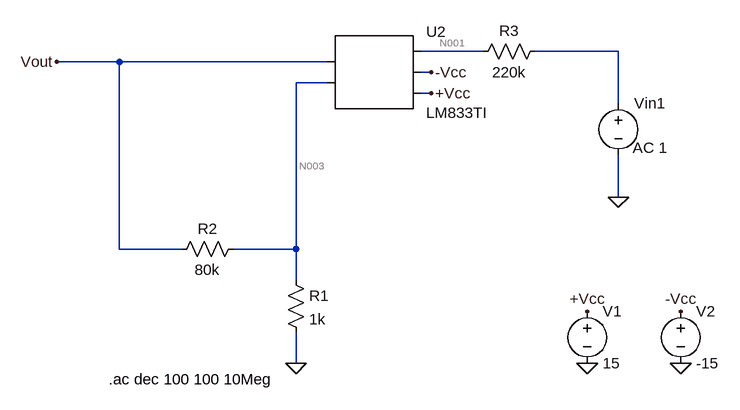
[diagram p0: schematic opamp LM833 TI.asc]
* opamp LM833 TI.asc
R1 N003 0 1k
R2 N003 Vout 80k
R3 N002 N001 220k
Vin1 N002 0 AC 1
V1 +Vcc 0 15
V2 -Vcc 0 -15
* U2: LM833TI (symbol AutoGenerated\LM833TI not available, pins judged from their places): pin1=Vout pin2=N003 pin3=N001 pin4=-Vcc pin5=+Vcc
.ac dec 100 100 10Meg
.backanno
.end

* Results of the author's LTspice run, read from the files saved beside the schematic
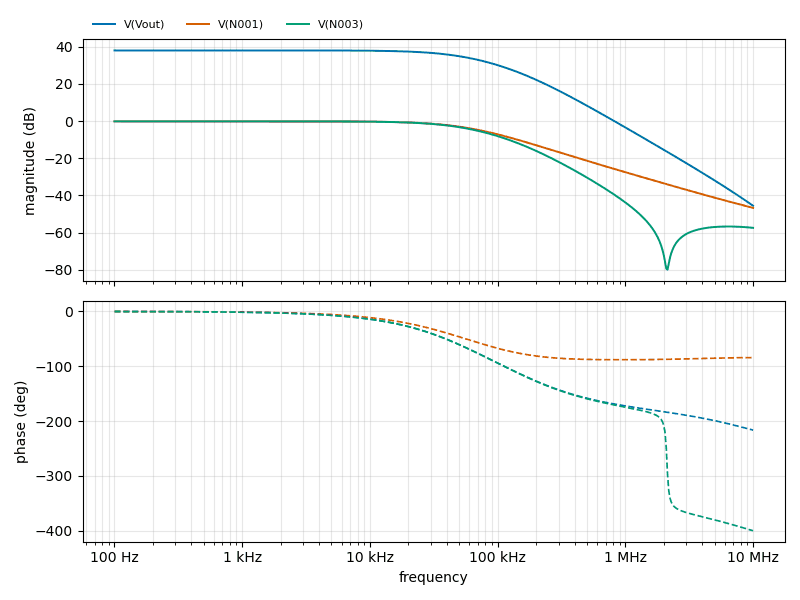
[diagram p1: AC Analysis of opamp LM833 TI.asc, plotted from the saved traces]
* AC Analysis, 1 run:
*   V(Vout): 38.06 dB at 100 Hz, -45.51 dB at 10 MHz, peak 38.06 dB at 100 Hz, 3 dB below the peak at 48.87 kHz
*   V(N001): -0.11 dB at 100 Hz, -46.68 dB at 10 MHz, peak -0.11 dB at 100 Hz, 3 dB below the peak at 51.72 kHz
*   V(N003): -0.11 dB at 100 Hz, -57.40 dB at 10 MHz, peak -0.11 dB at 100 Hz, 3 dB below the peak at 48.83 kHz